# Altium schematic sheet UI.SchDoc
size A3; Organization: Altium Limited; Address1: L3, 12a Rodborough Rd; Address2: Frenchs Forest; Address3: NSW; Address4: Australia 2086
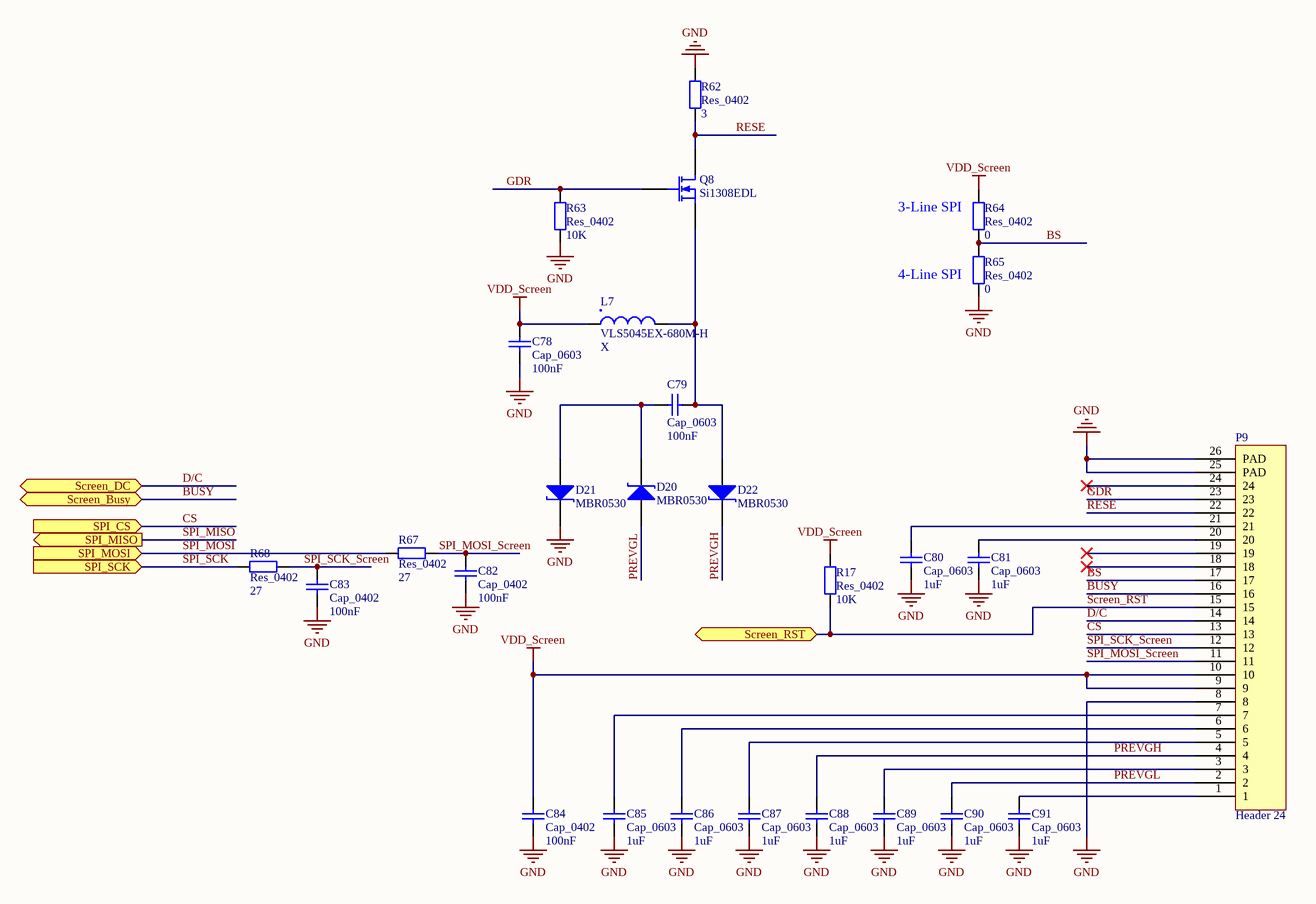
[diagram p0: UI.SchDoc]

## Parts
C78  Cap_0603  value 100nF  [0603]
C79  Cap_0603  value 100nF  [0603]
C80  Cap_0603  value 1uF  [0603]
C81  Cap_0603  value 1uF  [0603]
C82  Cap_0402  value 100nF  [0402]
C83  Cap_0402  value 100nF  [0402]
C84  Cap_0402  value 100nF  [0402]
C85  Cap_0603  value 1uF  [0603]
C86  Cap_0603  value 1uF  [0603]
C87  Cap_0603  value 1uF  [0603]
C88  Cap_0603  value 1uF  [0603]
C89  Cap_0603  value 1uF  [0603]
C90  Cap_0603  value 1uF  [0603]
C91  Cap_0603  value 1uF  [0603]
D20  MBR0530  [SOD-123]
D21  MBR0530  [SOD-123]
D22  MBR0530  [SOD-123]
L7  VLS5045EX-680M-H  value X  [VLS5045EX]
P9  Header 24  [Flex_EInc_Connector]
Q8  Si1308EDL  [SOT-23]
R17  Res_0402  value 10K  [0402]
R62  Res_0402  value 3  [0402]
R63  Res_0402  value 10K  [0402]
R64  Res_0402  value 0  [0402]
R65  Res_0402  value 0  [0402]
R67  Res_0402  value 27  [0402]
R68  Res_0402  value 27  [0402]

## Ports
Screen_Busy (bidir), Screen_DC (bidir), Screen_RST (bidir), SPI_CS (in), SPI_MISO (out), SPI_MOSI (in), SPI_SCK (in)

## Nets
GND: C78.1 C80.1 C81.1 C82.1 C83.1 C84.1 C85.1 C86.1 C87.1 C88.1 C89.1 C90.1 C91.1 D21.1(K) P9.8 P9.25(PAD) P9.26(PAD) R62.2 R63.1 R65.1
VDD_Screen: C78.2 C84.2 L7.1 P9.9 P9.10 R17.2 R64.2
BS: P9.17 R64.1 R65.2
BUSY: P9.16 ; port Screen_Busy
CS: P9.13 ; port SPI_CS
D/C: P9.14 ; port Screen_DC
GDR: P9.23 Q8.1(G) R63.2
PREVGH: C88.2 D22.1(K) P9.4
PREVGL: C90.2 D20.2(A) P9.2
RESE: P9.22 Q8.3(D) R62.1
Screen_RST: P9.15 R17.1 ; port Screen_RST
SPI_MISO: port SPI_MISO
SPI_MOSI: R67.1 ; port SPI_MOSI
SPI_MOSI_Screen: C82.2 P9.11 R67.2
SPI_SCK: R68.1 ; port SPI_SCK
SPI_SCK_Screen: C83.2 P9.12 R68.2
NetC79_1: C79.1 D20.1(K) D21.2(A)
NetC79_2: C79.2 D22.2(A) L7.2 Q8.2(S)
NetC80_2: C80.2 P9.21
NetC81_2: C81.2 P9.20
NetC85_2: C85.2 P9.7
NetC86_2: C86.2 P9.6
NetC87_2: C87.2 P9.5
NetC89_2: C89.2 P9.3
NetC91_2: C91.2 P9.1

Not connected (* = marked no-connect by the designer): P9 18* 19* 24*

## Notes on the sheet
- (near R64) 3-Line SPI
- (near R65) 4-Line SPI
- Title
- Size:
- Date:
- A3
- Number:
- Time:
- Revision:
- Sheet
- of
- File:

## Library data of the parts
C78-C81 C85-C91 = Cap_0603: Capacitor; Published: 8-Jun-2000; LatestRevisionDate: 17-Jul-2002; LatestRevisionNote: Re-released for DXP Platform.; PackageReference: RAD-0.3; Publisher: Altium Limited; PackageDescription: Radial Cap, Thru-Hole; 2 Leads; 0.3 in Pin Spacing
C82-C84 = Cap_0402: Capacitor; Published: 8-Jun-2000; LatestRevisionDate: 17-Jul-2002; LatestRevisionNote: Re-released for DXP Platform.; PackageReference: RAD-0.3; Publisher: Altium Limited; PackageDescription: Radial Cap, Thru-Hole; 2 Leads; 0.3 in Pin Spacing
D20-D22 = MBR0530: SCHOTTKY BARRIER / RECTIFIER; Published: 8-Jun-2000; LatestRevisionDate: 08-Jul-2005; LatestRevisionNote: Mech Layer 1 removed.; PackageReference: LED-0; Publisher: Altium Limited; PackageDescription: LED; 2 Leads
L7 = VLS5045EX-680M-H: Inductor 68 uH
P9 = Header 24: Header, 24-Pin; LatestRevisionDate: 17-Jul-2002; LatestRevisionNote: Re-released for DXP Platform.; Publisher: Altium Limited
Q8 = Si1308EDL: N-Channel MOSFET; Published: 8-Jun-2000; LatestRevisionDate: 17-Jul-2002; LatestRevisionNote: Re-released for DXP Platform.; PackageVersion: 1995/1996; PackageReference: E3; Publisher: Altium Limited; PackageDescription: TO, Flat Index; 3 In-Line, Axial Leads; Body Dia. 4.6mm; Lead Dia. 0.5 mm (max)
R17 R62-R65 R67 R68 = Res_0402: Resistor; Published: 8-Jun-2000; LatestRevisionDate: 17-Jul-2002; LatestRevisionNote: Re-released for DXP Platform.; PackageReference: AXIAL-0.4; Publisher: Altium Limited; PackageDescription: Axial Device, Thru-Hole; 2 Leads; 0.4 in Pin Spacing